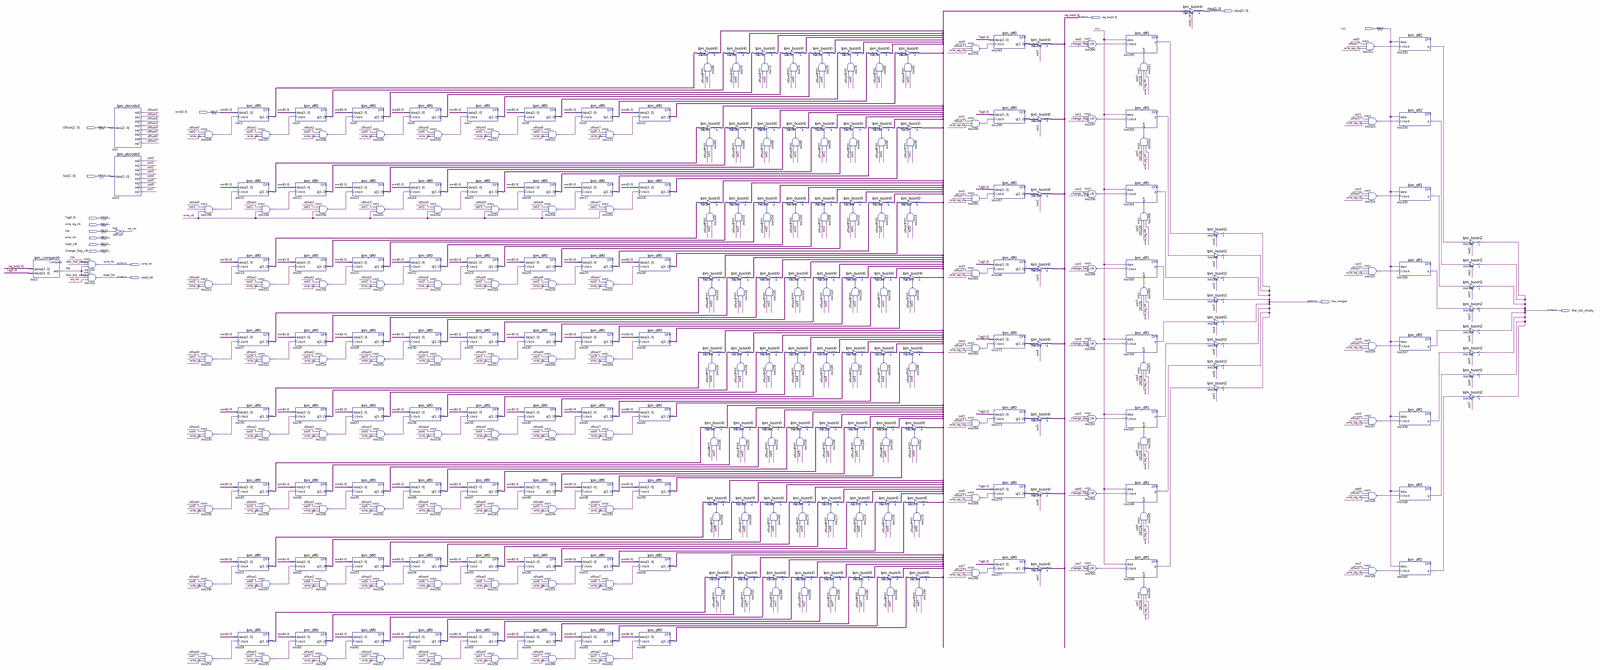
[diagram p0: schematic sheet, whole]
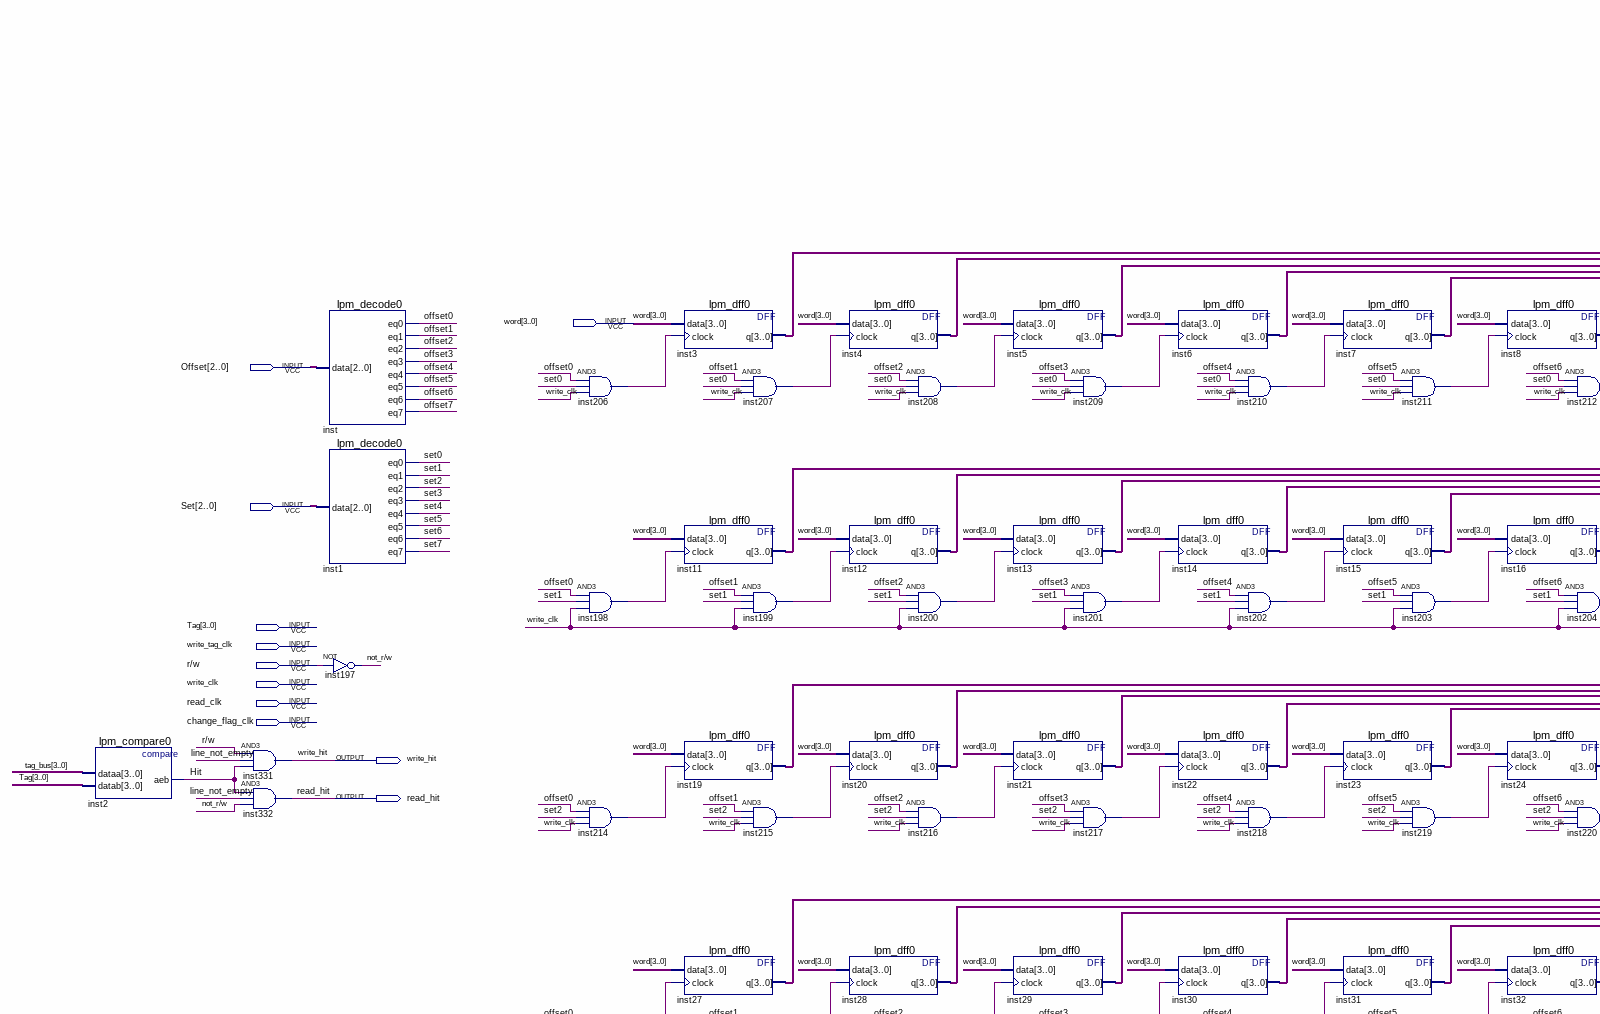
[diagram p1: schematic sheet, upper left part]
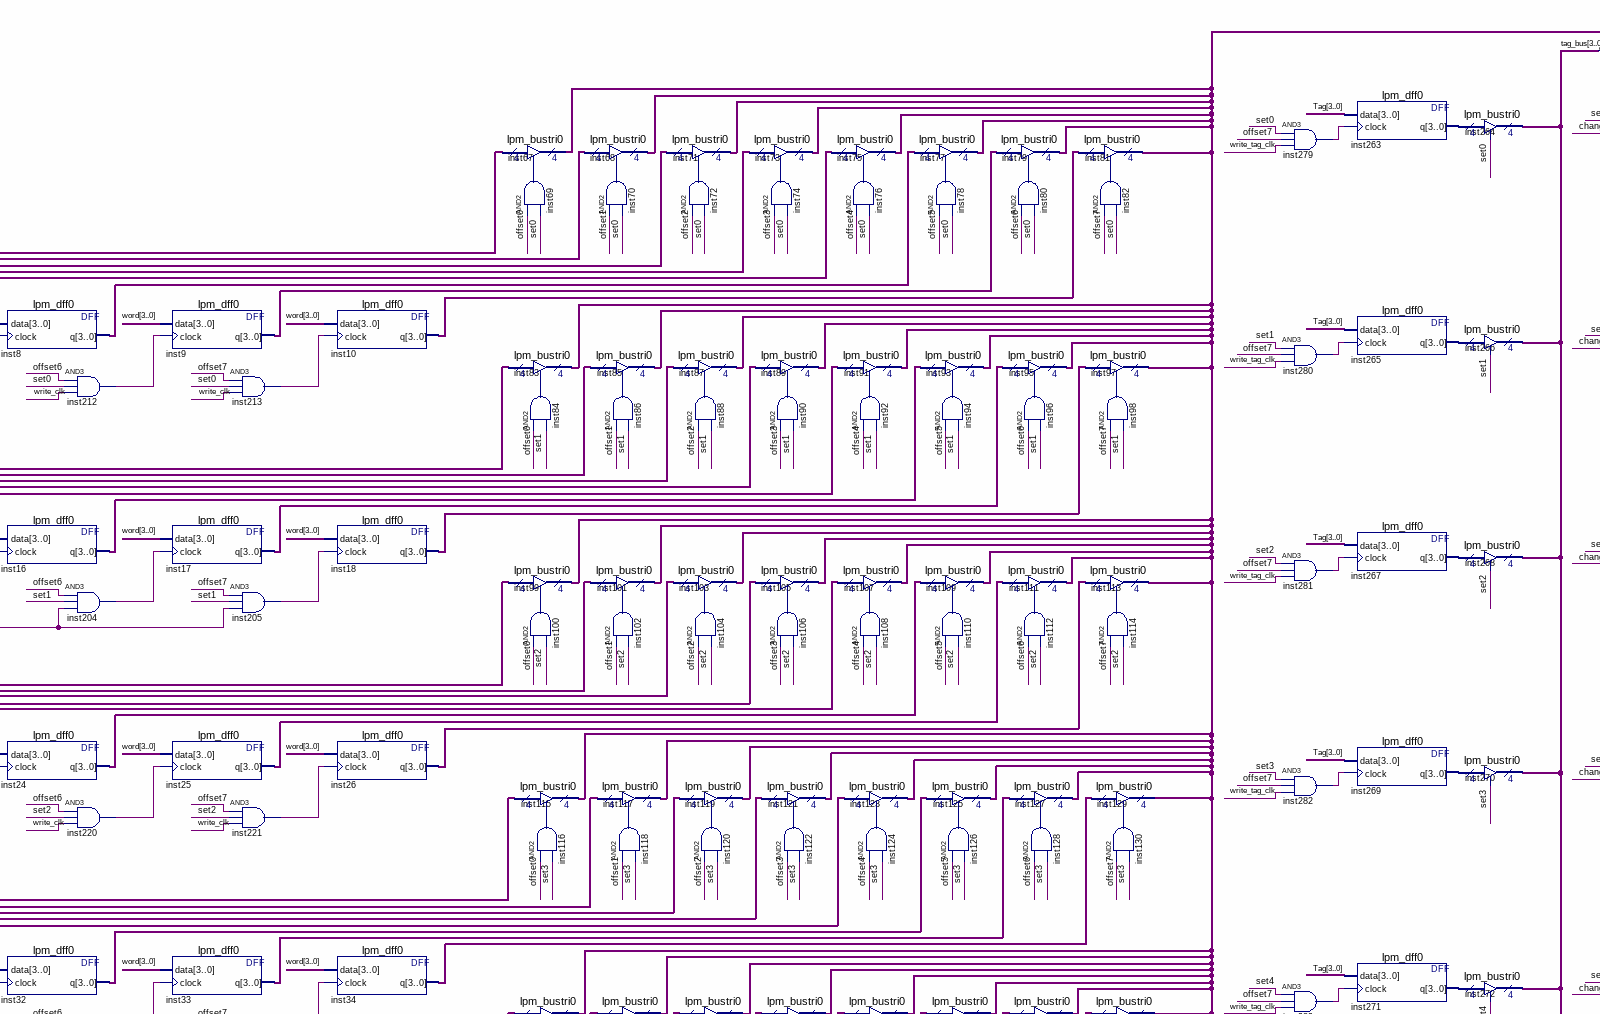
[diagram p2: schematic sheet, upper centre part]
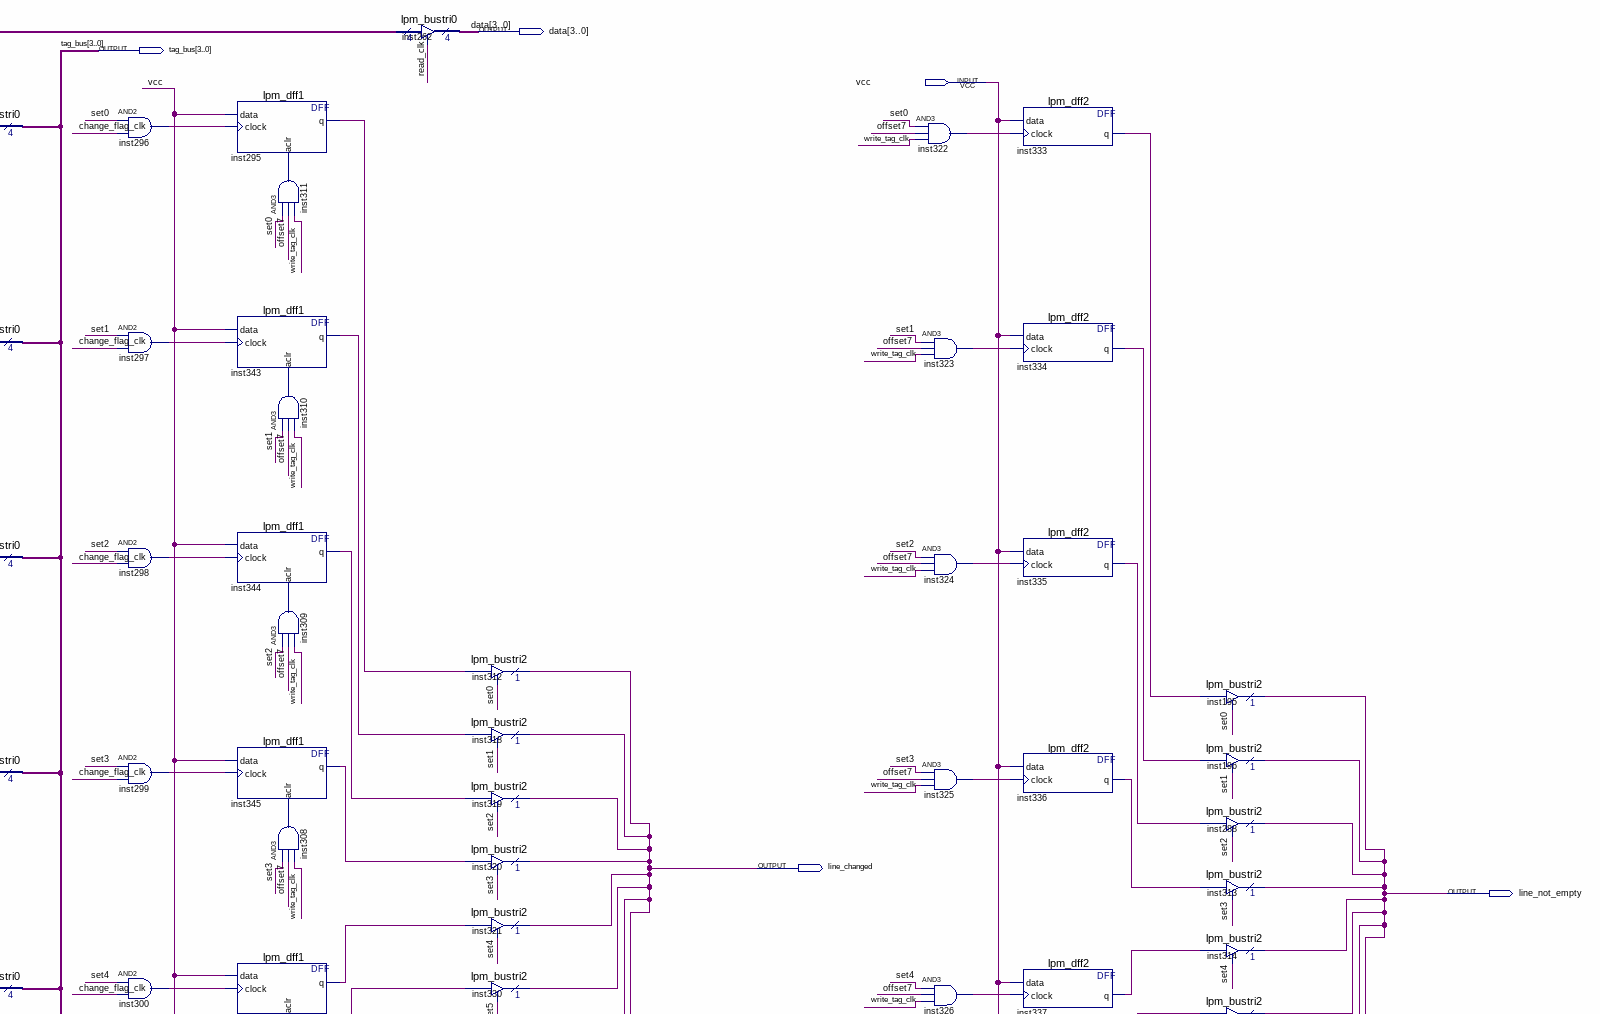
[diagram p3: schematic sheet, upper right part]
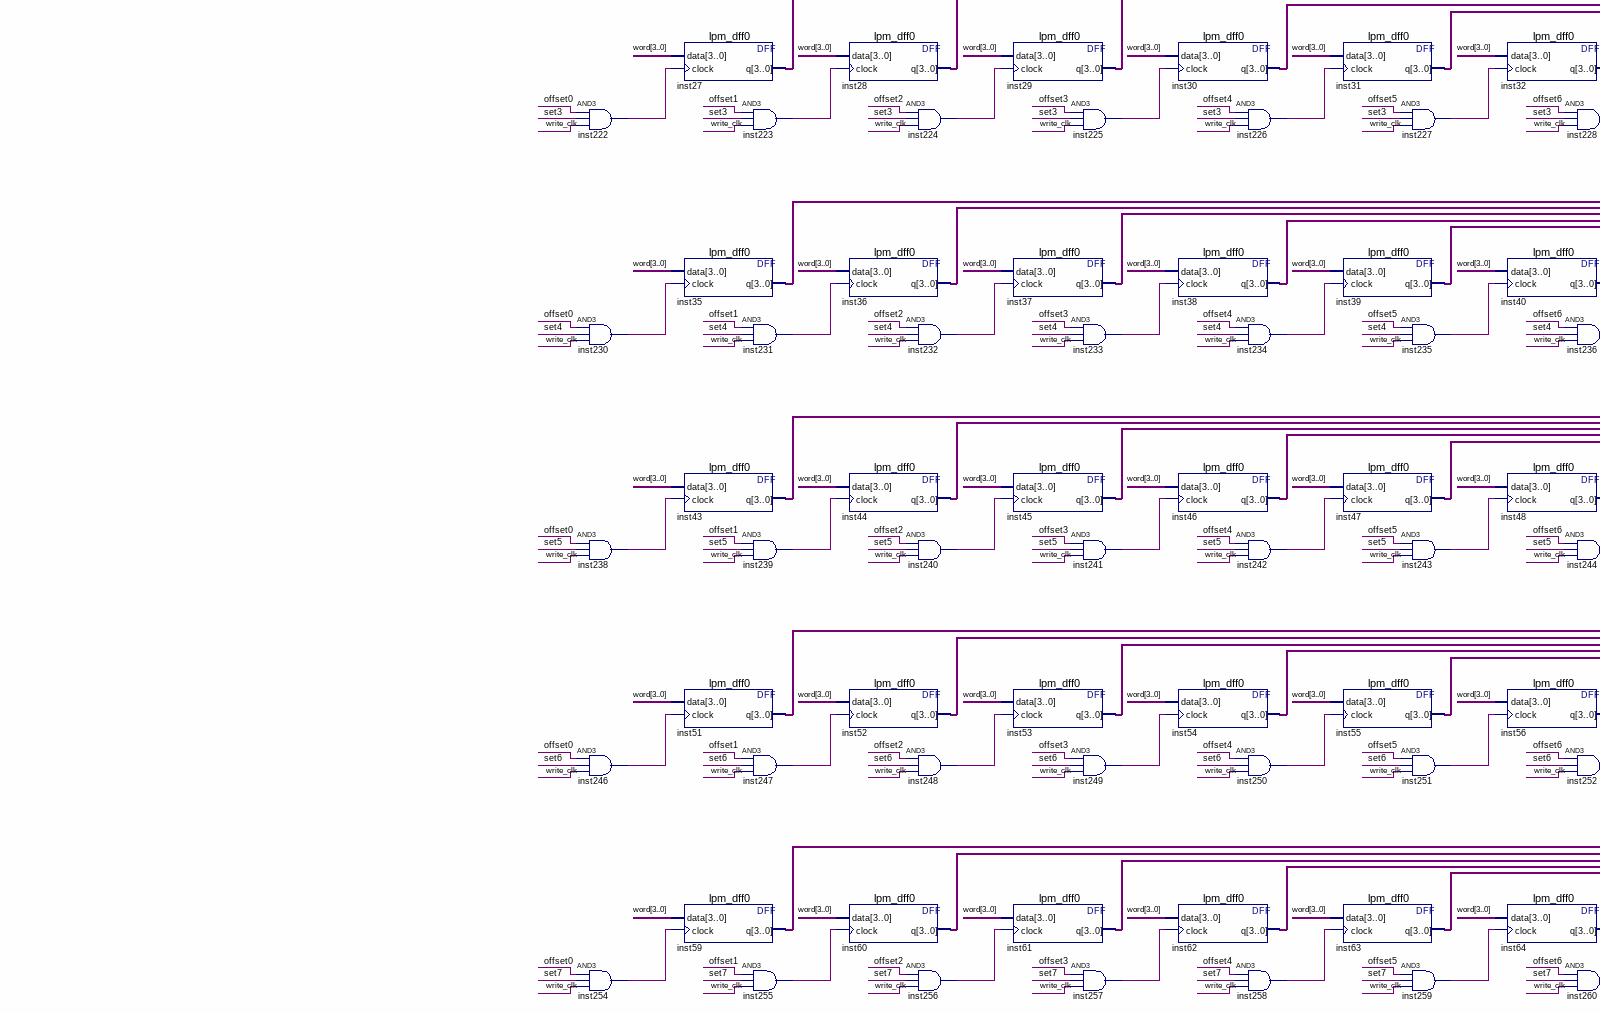
[diagram p4: schematic sheet, lower left part]
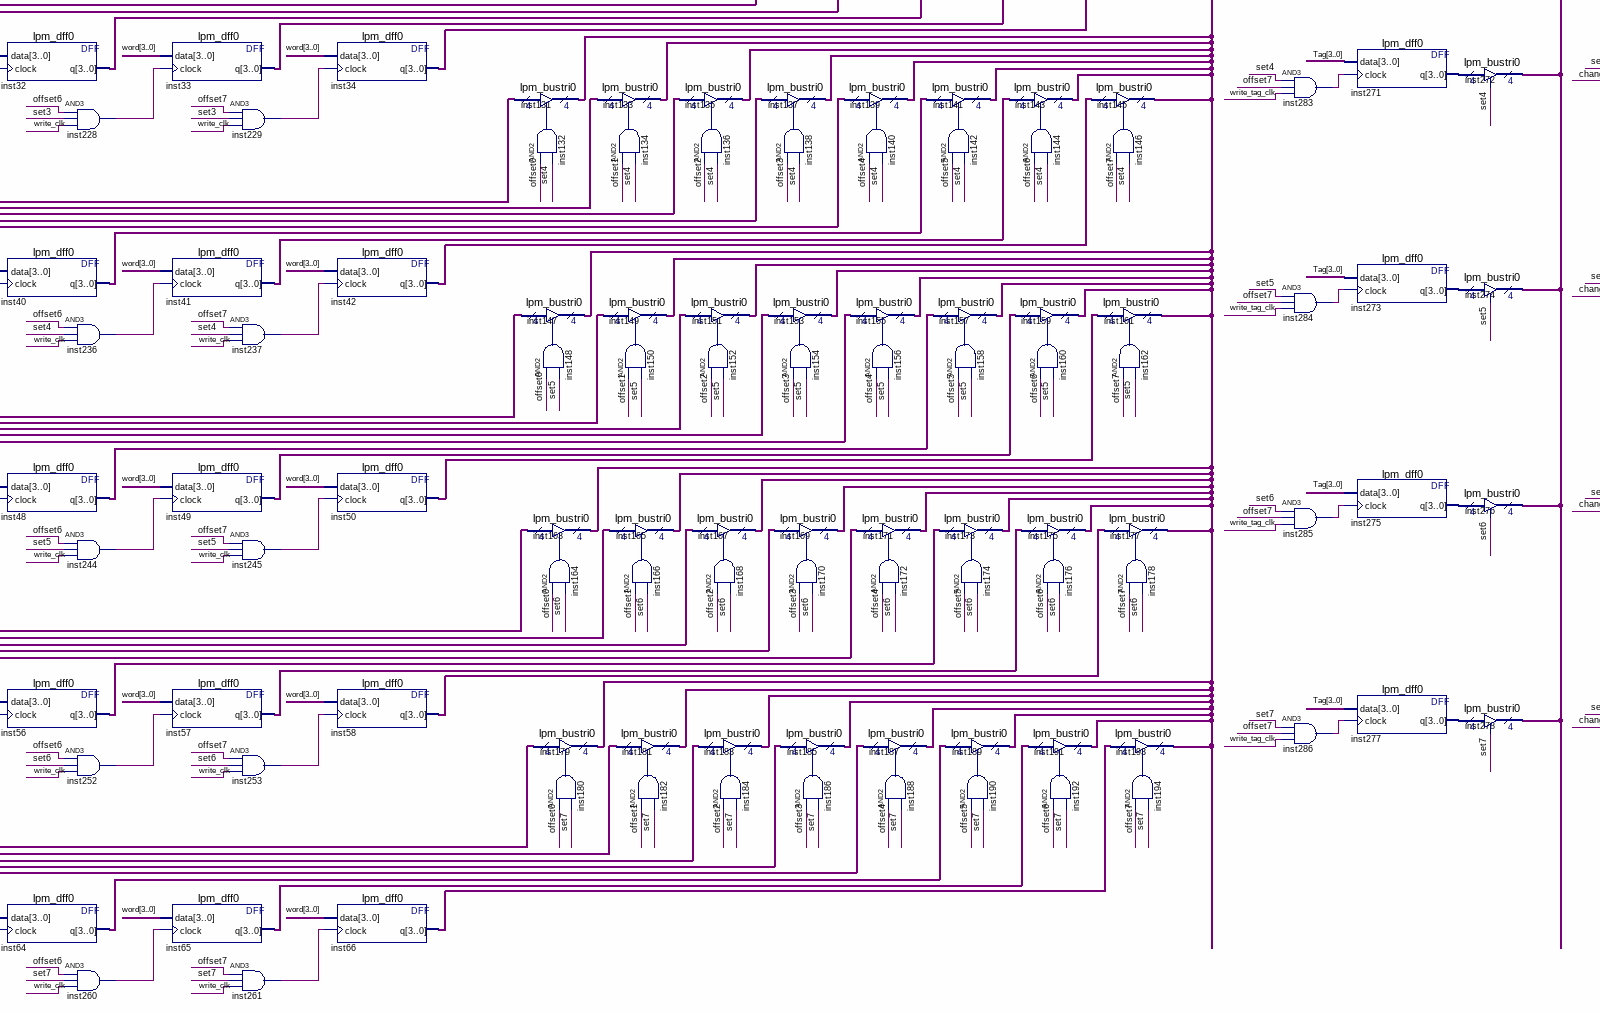
[diagram p5: schematic sheet, lower centre part]
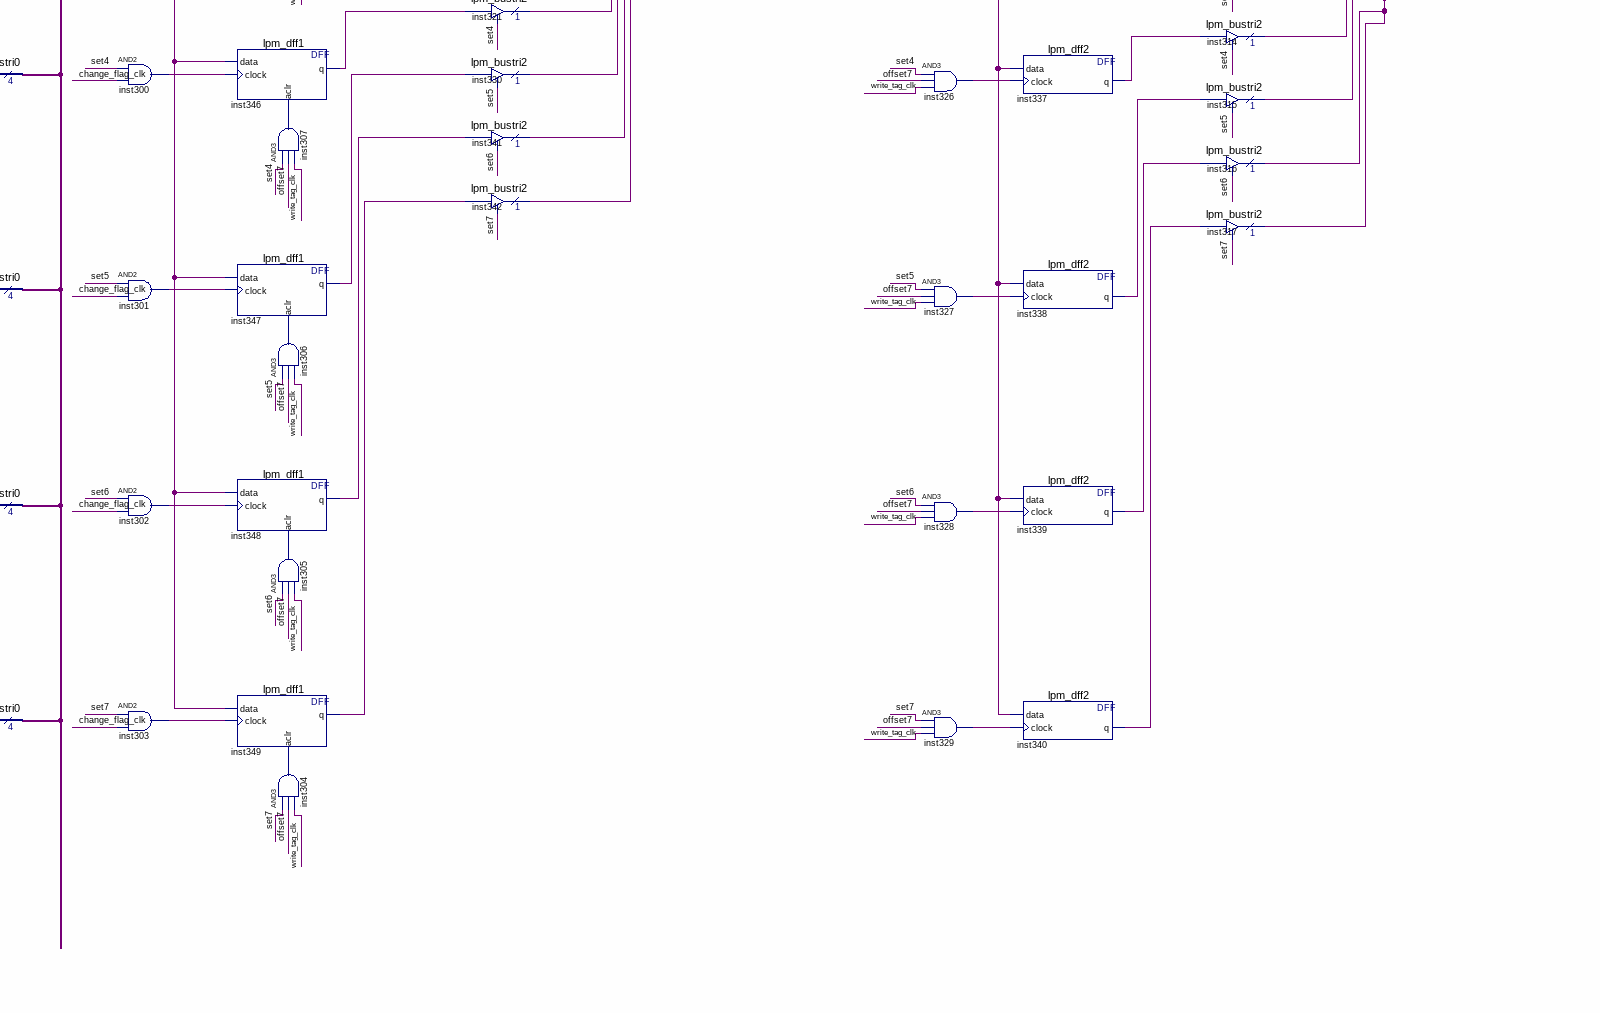
[diagram p6: schematic sheet, lower right part]
// Quartus schematic Cache.bdf as structural Verilog: 343 symbols, 16 pins
module Cache (
  input  vcc,
  input  [3:0] word,
  input  [2:0] Offset,
  input  [2:0] Set,
  input  [3:0] Tag,
  input  write_tag_clk,
  input  \r/w ,
  input  write_clk,
  input  read_clk,
  input  change_flag_clk,
  output [3:0] data,
  output [3:0] tag_bus,
  output write_hit,
  output read_hit,
  output line_changed,
  output line_not_empty
);

  wire Hit, inst69_out, inst70_out, inst72_out, inst74_out, inst76_out, inst78_out, inst80_out, inst82_out,
       inst84_out, inst86_out, inst88_out, inst90_out, inst92_out, inst94_out, inst96_out, inst98_out,
       inst100_out, inst102_out, inst104_out, inst106_out, inst108_out, inst110_out, inst112_out,
       inst114_out, inst116_out, inst118_out, inst120_out, inst122_out, inst124_out, inst126_out,
       inst128_out, inst130_out, inst132_out, inst134_out, inst136_out, inst138_out, inst140_out,
       inst142_out, inst144_out, inst146_out, inst148_out, inst150_out, inst152_out, inst154_out,
       inst156_out, inst158_out, inst160_out, inst162_out, inst164_out, inst166_out, inst168_out,
       inst170_out, inst172_out, inst174_out, inst176_out, inst178_out, inst180_out, inst182_out,
       inst184_out, inst186_out, inst188_out, inst190_out, inst192_out, inst194_out, inst198_out,
       inst199_out, inst200_out, inst201_out, inst202_out, inst203_out, inst204_out, inst205_out,
       inst206_out, inst207_out, inst208_out, inst209_out, inst210_out, inst211_out, inst212_out,
       inst213_out, inst214_out, inst215_out, inst216_out, inst217_out, inst218_out, inst219_out,
       inst220_out, inst221_out, inst222_out, inst223_out, inst224_out, inst225_out, inst226_out,
       inst227_out, inst228_out, inst229_out, inst230_out, inst231_out, inst232_out, inst233_out,
       inst234_out, inst235_out, inst236_out, inst237_out, inst238_out, inst239_out, inst240_out,
       inst241_out, inst242_out, inst243_out, inst244_out, inst245_out, inst246_out, inst247_out,
       inst248_out, inst249_out, inst250_out, inst251_out, inst252_out, inst253_out, inst254_out,
       inst255_out, inst256_out, inst257_out, inst258_out, inst259_out, inst260_out, inst261_out,
       inst279_out, inst280_out, inst281_out, inst282_out, inst283_out, inst284_out, inst285_out,
       inst286_out, inst295_q, inst296_out, inst297_out, inst298_out, inst299_out, inst300_out, inst301_out,
       inst302_out, inst303_out, inst304_out, inst305_out, inst306_out, inst307_out, inst308_out,
       inst309_out, inst310_out, inst311_out, inst322_out, inst323_out, inst324_out, inst325_out,
       inst326_out, inst327_out, inst328_out, inst329_out, inst333_q, inst334_q, inst335_q, inst336_q,
       inst337_q, inst338_q, inst339_q, inst340_q, inst343_q, inst344_q, inst345_q, inst346_q, inst347_q,
       inst348_q, inst349_q, \not_r/w , offset3, offset4, offset5, offset6, offset7, set3, set4, set5, set6,
       set7;
  wire [3:0] inst3_q, inst4_q, inst5_q, inst6_q, inst7_q, inst8_q, inst9_q, inst10_q, inst11_q, inst12_q,
       inst13_q, inst14_q, inst15_q, inst16_q, inst17_q, inst18_q, inst19_q, inst20_q, inst21_q, inst22_q,
       inst23_q, inst24_q, inst25_q, inst26_q, inst27_q, inst28_q, inst29_q, inst30_q, inst31_q, inst32_q,
       inst33_q, inst34_q, inst35_q, inst36_q, inst37_q, inst38_q, inst39_q, inst40_q, inst41_q, inst42_q,
       inst43_q, inst44_q, inst45_q, inst46_q, inst47_q, inst48_q, inst49_q, inst50_q, inst51_q, inst52_q,
       inst53_q, inst54_q, inst55_q, inst56_q, inst57_q, inst58_q, inst59_q, inst60_q, inst61_q, inst62_q,
       inst63_q, inst64_q, inst65_q, inst66_q, inst67_tridata, inst263_q, inst265_q, inst267_q, inst269_q,
       inst271_q, inst273_q, inst275_q, inst277_q;

  lpm_compare0 inst2 (.dataa(tag_bus), .datab(Tag), .aeb(Hit));
  and inst331 (write_hit, \r/w , line_not_empty, Hit);
  and inst332 (read_hit, Hit, line_not_empty, \not_r/w );
  lpm_decode0 inst (
    .data(Offset), .eq0(Offset[0]), .eq1(Offset[1]), .eq2(Offset[2]), .eq3(offset3), .eq4(offset4),
    .eq5(offset5), .eq6(offset6), .eq7(offset7));
  lpm_decode0 inst1 (
    .data(Set), .eq0(Set[0]), .eq1(Set[1]), .eq2(Set[2]), .eq3(set3), .eq4(set4), .eq5(set5), .eq6(set6),
    .eq7(set7));
  not inst197 (\not_r/w , \r/w );
  and inst206 (inst206_out, Offset[0], Set[0], write_clk);
  and inst198 (inst198_out, Offset[0], Set[1], write_clk);
  and inst214 (inst214_out, Offset[0], Set[2], write_clk);
  and inst222 (inst222_out, Offset[0], set3, write_clk);
  and inst230 (inst230_out, Offset[0], set4, write_clk);
  and inst238 (inst238_out, Offset[0], set5, write_clk);
  and inst246 (inst246_out, Offset[0], set6, write_clk);
  and inst254 (inst254_out, Offset[0], set7, write_clk);
  lpm_dff0 inst3 (.data(word), .clock(inst206_out), .q(inst3_q));
  lpm_dff0 inst11 (.data(word), .clock(inst198_out), .q(inst11_q));
  lpm_dff0 inst19 (.data(word), .clock(inst214_out), .q(inst19_q));
  lpm_dff0 inst27 (.data(word), .clock(inst222_out), .q(inst27_q));
  lpm_dff0 inst35 (.data(word), .clock(inst230_out), .q(inst35_q));
  lpm_dff0 inst43 (.data(word), .clock(inst238_out), .q(inst43_q));
  lpm_dff0 inst51 (.data(word), .clock(inst246_out), .q(inst51_q));
  lpm_dff0 inst59 (.data(word), .clock(inst254_out), .q(inst59_q));
  and inst207 (inst207_out, Offset[1], Set[0], write_clk);
  and inst199 (inst199_out, Offset[1], Set[1], write_clk);
  and inst215 (inst215_out, Offset[1], Set[2], write_clk);
  and inst223 (inst223_out, Offset[1], set3, write_clk);
  and inst231 (inst231_out, Offset[1], set4, write_clk);
  and inst239 (inst239_out, Offset[1], set5, write_clk);
  and inst247 (inst247_out, Offset[1], set6, write_clk);
  and inst255 (inst255_out, Offset[1], set7, write_clk);
  lpm_dff0 inst4 (.data(word), .clock(inst207_out), .q(inst4_q));
  lpm_dff0 inst12 (.data(word), .clock(inst199_out), .q(inst12_q));
  lpm_dff0 inst20 (.data(word), .clock(inst215_out), .q(inst20_q));
  lpm_dff0 inst28 (.data(word), .clock(inst223_out), .q(inst28_q));
  lpm_dff0 inst36 (.data(word), .clock(inst231_out), .q(inst36_q));
  lpm_dff0 inst44 (.data(word), .clock(inst239_out), .q(inst44_q));
  lpm_dff0 inst52 (.data(word), .clock(inst247_out), .q(inst52_q));
  lpm_dff0 inst60 (.data(word), .clock(inst255_out), .q(inst60_q));
  and inst208 (inst208_out, Offset[2], Set[0], write_clk);
  and inst200 (inst200_out, Offset[2], Set[1], write_clk);
  and inst216 (inst216_out, Offset[2], Set[2], write_clk);
  and inst224 (inst224_out, Offset[2], set3, write_clk);
  and inst232 (inst232_out, Offset[2], set4, write_clk);
  and inst240 (inst240_out, Offset[2], set5, write_clk);
  and inst248 (inst248_out, Offset[2], set6, write_clk);
  and inst256 (inst256_out, Offset[2], set7, write_clk);
  lpm_dff0 inst5 (.data(word), .clock(inst208_out), .q(inst5_q));
  lpm_dff0 inst13 (.data(word), .clock(inst200_out), .q(inst13_q));
  lpm_dff0 inst21 (.data(word), .clock(inst216_out), .q(inst21_q));
  lpm_dff0 inst29 (.data(word), .clock(inst224_out), .q(inst29_q));
  lpm_dff0 inst37 (.data(word), .clock(inst232_out), .q(inst37_q));
  lpm_dff0 inst45 (.data(word), .clock(inst240_out), .q(inst45_q));
  lpm_dff0 inst53 (.data(word), .clock(inst248_out), .q(inst53_q));
  lpm_dff0 inst61 (.data(word), .clock(inst256_out), .q(inst61_q));
  and inst209 (inst209_out, offset3, Set[0], write_clk);
  and inst201 (inst201_out, offset3, Set[1], write_clk);
  and inst217 (inst217_out, offset3, Set[2], write_clk);
  and inst225 (inst225_out, offset3, set3, write_clk);
  and inst233 (inst233_out, offset3, set4, write_clk);
  and inst241 (inst241_out, offset3, set5, write_clk);
  and inst249 (inst249_out, offset3, set6, write_clk);
  and inst257 (inst257_out, offset3, set7, write_clk);
  lpm_dff0 inst6 (.data(word), .clock(inst209_out), .q(inst6_q));
  lpm_dff0 inst14 (.data(word), .clock(inst201_out), .q(inst14_q));
  lpm_dff0 inst22 (.data(word), .clock(inst217_out), .q(inst22_q));
  lpm_dff0 inst30 (.data(word), .clock(inst225_out), .q(inst30_q));
  lpm_dff0 inst38 (.data(word), .clock(inst233_out), .q(inst38_q));
  lpm_dff0 inst46 (.data(word), .clock(inst241_out), .q(inst46_q));
  lpm_dff0 inst54 (.data(word), .clock(inst249_out), .q(inst54_q));
  lpm_dff0 inst62 (.data(word), .clock(inst257_out), .q(inst62_q));
  and inst210 (inst210_out, offset4, Set[0], write_clk);
  and inst202 (inst202_out, offset4, Set[1], write_clk);
  and inst218 (inst218_out, offset4, Set[2], write_clk);
  and inst226 (inst226_out, offset4, set3, write_clk);
  and inst234 (inst234_out, offset4, set4, write_clk);
  and inst242 (inst242_out, offset4, set5, write_clk);
  and inst250 (inst250_out, offset4, set6, write_clk);
  and inst258 (inst258_out, offset4, set7, write_clk);
  lpm_dff0 inst7 (.data(word), .clock(inst210_out), .q(inst7_q));
  lpm_dff0 inst15 (.data(word), .clock(inst202_out), .q(inst15_q));
  lpm_dff0 inst23 (.data(word), .clock(inst218_out), .q(inst23_q));
  lpm_dff0 inst31 (.data(word), .clock(inst226_out), .q(inst31_q));
  lpm_dff0 inst39 (.data(word), .clock(inst234_out), .q(inst39_q));
  lpm_dff0 inst47 (.data(word), .clock(inst242_out), .q(inst47_q));
  lpm_dff0 inst55 (.data(word), .clock(inst250_out), .q(inst55_q));
  lpm_dff0 inst63 (.data(word), .clock(inst258_out), .q(inst63_q));
  and inst211 (inst211_out, offset5, Set[0], write_clk);
  and inst203 (inst203_out, offset5, Set[1], write_clk);
  and inst219 (inst219_out, offset5, Set[2], write_clk);
  and inst227 (inst227_out, offset5, set3, write_clk);
  and inst235 (inst235_out, offset5, set4, write_clk);
  and inst243 (inst243_out, offset5, set5, write_clk);
  and inst251 (inst251_out, offset5, set6, write_clk);
  and inst259 (inst259_out, offset5, set7, write_clk);
  lpm_dff0 inst8 (.data(word), .clock(inst211_out), .q(inst8_q));
  lpm_dff0 inst16 (.data(word), .clock(inst203_out), .q(inst16_q));
  lpm_dff0 inst24 (.data(word), .clock(inst219_out), .q(inst24_q));
  lpm_dff0 inst32 (.data(word), .clock(inst227_out), .q(inst32_q));
  lpm_dff0 inst40 (.data(word), .clock(inst235_out), .q(inst40_q));
  lpm_dff0 inst48 (.data(word), .clock(inst243_out), .q(inst48_q));
  lpm_dff0 inst56 (.data(word), .clock(inst251_out), .q(inst56_q));
  lpm_dff0 inst64 (.data(word), .clock(inst259_out), .q(inst64_q));
  and inst212 (inst212_out, offset6, Set[0], write_clk);
  and inst204 (inst204_out, offset6, Set[1], write_clk);
  and inst220 (inst220_out, offset6, Set[2], write_clk);
  and inst228 (inst228_out, offset6, set3, write_clk);
  and inst236 (inst236_out, offset6, set4, write_clk);
  and inst244 (inst244_out, offset6, set5, write_clk);
  and inst252 (inst252_out, offset6, set6, write_clk);
  and inst260 (inst260_out, offset6, set7, write_clk);
  lpm_dff0 inst9 (.data(word), .clock(inst212_out), .q(inst9_q));
  lpm_dff0 inst17 (.data(word), .clock(inst204_out), .q(inst17_q));
  lpm_dff0 inst25 (.data(word), .clock(inst220_out), .q(inst25_q));
  lpm_dff0 inst33 (.data(word), .clock(inst228_out), .q(inst33_q));
  lpm_dff0 inst41 (.data(word), .clock(inst236_out), .q(inst41_q));
  lpm_dff0 inst49 (.data(word), .clock(inst244_out), .q(inst49_q));
  lpm_dff0 inst57 (.data(word), .clock(inst252_out), .q(inst57_q));
  lpm_dff0 inst65 (.data(word), .clock(inst260_out), .q(inst65_q));
  and inst213 (inst213_out, offset7, Set[0], write_clk);
  and inst205 (inst205_out, offset7, Set[1], write_clk);
  and inst221 (inst221_out, offset7, Set[2], write_clk);
  and inst229 (inst229_out, offset7, set3, write_clk);
  and inst237 (inst237_out, offset7, set4, write_clk);
  and inst245 (inst245_out, offset7, set5, write_clk);
  and inst253 (inst253_out, offset7, set6, write_clk);
  and inst261 (inst261_out, offset7, set7, write_clk);
  lpm_dff0 inst10 (.data(word), .clock(inst213_out), .q(inst10_q));
  lpm_dff0 inst18 (.data(word), .clock(inst205_out), .q(inst18_q));
  lpm_dff0 inst26 (.data(word), .clock(inst221_out), .q(inst26_q));
  lpm_dff0 inst34 (.data(word), .clock(inst229_out), .q(inst34_q));
  lpm_dff0 inst42 (.data(word), .clock(inst237_out), .q(inst42_q));
  lpm_dff0 inst50 (.data(word), .clock(inst245_out), .q(inst50_q));
  lpm_dff0 inst58 (.data(word), .clock(inst253_out), .q(inst58_q));
  lpm_dff0 inst66 (.data(word), .clock(inst261_out), .q(inst66_q));
  lpm_bustri0 inst67 (.enabledt(inst69_out), .data(inst3_q), .tridata(inst67_tridata));
  and inst69 (inst69_out, Offset[0], Set[0]);
  lpm_bustri0 inst83 (.enabledt(inst84_out), .data(inst11_q), .tridata(inst67_tridata));
  lpm_bustri0 inst99 (.enabledt(inst100_out), .data(inst19_q), .tridata(inst67_tridata));
  lpm_bustri0 inst115 (.enabledt(inst116_out), .data(inst27_q), .tridata(inst67_tridata));
  lpm_bustri0 inst131 (.enabledt(inst132_out), .data(inst35_q), .tridata(inst67_tridata));
  and inst84 (inst84_out, Offset[0], Set[1]);
  and inst100 (inst100_out, Offset[0], Set[2]);
  and inst116 (inst116_out, Offset[0], set3);
  and inst132 (inst132_out, Offset[0], set4);
  lpm_bustri0 inst147 (.enabledt(inst148_out), .data(inst43_q), .tridata(inst67_tridata));
  and inst148 (inst148_out, Offset[0], set5);
  lpm_bustri0 inst163 (.enabledt(inst164_out), .data(inst51_q), .tridata(inst67_tridata));
  and inst164 (inst164_out, Offset[0], set6);
  lpm_bustri0 inst179 (.enabledt(inst180_out), .data(inst59_q), .tridata(inst67_tridata));
  and inst180 (inst180_out, Offset[0], set7);
  lpm_bustri0 inst68 (.enabledt(inst70_out), .data(inst4_q), .tridata(inst67_tridata));
  and inst70 (inst70_out, Offset[1], Set[0]);
  lpm_bustri0 inst85 (.enabledt(inst86_out), .data(inst12_q), .tridata(inst67_tridata));
  and inst86 (inst86_out, Offset[1], Set[1]);
  lpm_bustri0 inst101 (.enabledt(inst102_out), .data(inst20_q), .tridata(inst67_tridata));
  and inst102 (inst102_out, Offset[1], Set[2]);
  lpm_bustri0 inst117 (.enabledt(inst118_out), .data(inst28_q), .tridata(inst67_tridata));
  and inst118 (inst118_out, Offset[1], set3);
  lpm_bustri0 inst133 (.enabledt(inst134_out), .data(inst36_q), .tridata(inst67_tridata));
  and inst134 (inst134_out, Offset[1], set4);
  lpm_bustri0 inst149 (.enabledt(inst150_out), .data(inst44_q), .tridata(inst67_tridata));
  and inst150 (inst150_out, Offset[1], set5);
  lpm_bustri0 inst165 (.enabledt(inst166_out), .data(inst52_q), .tridata(inst67_tridata));
  lpm_bustri0 inst181 (.enabledt(inst182_out), .data(inst60_q), .tridata(inst67_tridata));
  lpm_bustri0 inst71 (.enabledt(inst72_out), .data(inst5_q), .tridata(inst67_tridata));
  and inst166 (inst166_out, Offset[1], set6);
  and inst182 (inst182_out, Offset[1], set7);
  and inst72 (inst72_out, Offset[2], Set[0]);
  lpm_bustri0 inst87 (.enabledt(inst88_out), .data(inst13_q), .tridata(inst67_tridata));
  and inst88 (inst88_out, Offset[2], Set[1]);
  lpm_bustri0 inst103 (.enabledt(inst104_out), .data(inst21_q), .tridata(inst67_tridata));
  and inst104 (inst104_out, Offset[2], Set[2]);
  lpm_bustri0 inst119 (.enabledt(inst120_out), .data(inst29_q), .tridata(inst67_tridata));
  and inst120 (inst120_out, Offset[2], set3);
  lpm_bustri0 inst135 (.enabledt(inst136_out), .data(inst37_q), .tridata(inst67_tridata));
  and inst136 (inst136_out, Offset[2], set4);
  lpm_bustri0 inst151 (.enabledt(inst152_out), .data(inst45_q), .tridata(inst67_tridata));
  and inst152 (inst152_out, Offset[2], set5);
  lpm_bustri0 inst167 (.enabledt(inst168_out), .data(inst53_q), .tridata(inst67_tridata));
  and inst168 (inst168_out, Offset[2], set6);
  lpm_bustri0 inst183 (.enabledt(inst184_out), .data(inst61_q), .tridata(inst67_tridata));
  and inst184 (inst184_out, Offset[2], set7);
  lpm_bustri0 inst73 (.enabledt(inst74_out), .data(inst6_q), .tridata(inst67_tridata));
  and inst74 (inst74_out, offset3, Set[0]);
  lpm_bustri0 inst89 (.enabledt(inst90_out), .data(inst14_q), .tridata(inst67_tridata));
  and inst90 (inst90_out, offset3, Set[1]);
  lpm_bustri0 inst105 (.enabledt(inst106_out), .data(inst22_q), .tridata(inst67_tridata));
  and inst106 (inst106_out, offset3, Set[2]);
  lpm_bustri0 inst121 (.enabledt(inst122_out), .data(inst30_q), .tridata(inst67_tridata));
  lpm_bustri0 inst137 (.enabledt(inst138_out), .data(inst38_q), .tridata(inst67_tridata));
  lpm_bustri0 inst153 (.enabledt(inst154_out), .data(inst46_q), .tridata(inst67_tridata));
  and inst122 (inst122_out, offset3, set3);
  and inst138 (inst138_out, offset3, set4);
  and inst154 (inst154_out, offset3, set5);
  lpm_bustri0 inst169 (.enabledt(inst170_out), .data(inst54_q), .tridata(inst67_tridata));
  and inst170 (inst170_out, offset3, set6);
  lpm_bustri0 inst185 (.enabledt(inst186_out), .data(inst62_q), .tridata(inst67_tridata));
  and inst186 (inst186_out, offset3, set7);
  lpm_bustri0 inst75 (.enabledt(inst76_out), .data(inst7_q), .tridata(inst67_tridata));
  and inst76 (inst76_out, offset4, Set[0]);
  lpm_bustri0 inst91 (.enabledt(inst92_out), .data(inst15_q), .tridata(inst67_tridata));
  and inst92 (inst92_out, offset4, Set[1]);
  lpm_bustri0 inst107 (.enabledt(inst108_out), .data(inst23_q), .tridata(inst67_tridata));
  and inst108 (inst108_out, offset4, Set[2]);
  lpm_bustri0 inst123 (.enabledt(inst124_out), .data(inst31_q), .tridata(inst67_tridata));
  and inst124 (inst124_out, offset4, set3);
  lpm_bustri0 inst139 (.enabledt(inst140_out), .data(inst39_q), .tridata(inst67_tridata));
  and inst140 (inst140_out, offset4, set4);
  lpm_bustri0 inst155 (.enabledt(inst156_out), .data(inst47_q), .tridata(inst67_tridata));
  and inst156 (inst156_out, offset4, set5);
  lpm_bustri0 inst171 (.enabledt(inst172_out), .data(inst55_q), .tridata(inst67_tridata));
  and inst172 (inst172_out, offset4, set6);
  lpm_bustri0 inst187 (.enabledt(inst188_out), .data(inst63_q), .tridata(inst67_tridata));
  lpm_bustri0 inst77 (.enabledt(inst78_out), .data(inst8_q), .tridata(inst67_tridata));
  lpm_bustri0 inst93 (.enabledt(inst94_out), .data(inst16_q), .tridata(inst67_tridata));
  lpm_bustri0 inst109 (.enabledt(inst110_out), .data(inst24_q), .tridata(inst67_tridata));
  and inst188 (inst188_out, offset4, set7);
  and inst78 (inst78_out, offset5, Set[0]);
  and inst94 (inst94_out, offset5, Set[1]);
  and inst110 (inst110_out, offset5, Set[2]);
  lpm_bustri0 inst125 (.enabledt(inst126_out), .data(inst32_q), .tridata(inst67_tridata));
  and inst126 (inst126_out, offset5, set3);
  lpm_bustri0 inst141 (.enabledt(inst142_out), .data(inst40_q), .tridata(inst67_tridata));
  and inst142 (inst142_out, offset5, set4);
  lpm_bustri0 inst157 (.enabledt(inst158_out), .data(inst48_q), .tridata(inst67_tridata));
  and inst158 (inst158_out, offset5, set5);
  lpm_bustri0 inst173 (.enabledt(inst174_out), .data(inst56_q), .tridata(inst67_tridata));
  and inst174 (inst174_out, offset5, set6);
  lpm_bustri0 inst189 (.enabledt(inst190_out), .data(inst64_q), .tridata(inst67_tridata));
  and inst190 (inst190_out, offset5, set7);
  lpm_bustri0 inst79 (.enabledt(inst80_out), .data(inst9_q), .tridata(inst67_tridata));
  and inst80 (inst80_out, offset6, Set[0]);
  lpm_bustri0 inst95 (.enabledt(inst96_out), .data(inst17_q), .tridata(inst67_tridata));
  and inst96 (inst96_out, offset6, Set[1]);
  lpm_bustri0 inst111 (.enabledt(inst112_out), .data(inst25_q), .tridata(inst67_tridata));
  and inst112 (inst112_out, offset6, Set[2]);
  lpm_bustri0 inst127 (.enabledt(inst128_out), .data(inst33_q), .tridata(inst67_tridata));
  and inst128 (inst128_out, offset6, set3);
  lpm_bustri0 inst143 (.enabledt(inst144_out), .data(inst41_q), .tridata(inst67_tridata));
  and inst144 (inst144_out, offset6, set4);
  lpm_bustri0 inst159 (.enabledt(inst160_out), .data(inst49_q), .tridata(inst67_tridata));
  lpm_bustri0 inst175 (.enabledt(inst176_out), .data(inst57_q), .tridata(inst67_tridata));
  and inst160 (inst160_out, offset6, set5);
  and inst176 (inst176_out, offset6, set6);
  lpm_bustri0 inst191 (.enabledt(inst192_out), .data(inst65_q), .tridata(inst67_tridata));
  and inst192 (inst192_out, offset6, set7);
  lpm_bustri0 inst81 (.enabledt(inst82_out), .data(inst10_q), .tridata(inst67_tridata));
  and inst82 (inst82_out, offset7, Set[0]);
  lpm_bustri0 inst97 (.enabledt(inst98_out), .data(inst18_q), .tridata(inst67_tridata));
  and inst98 (inst98_out, offset7, Set[1]);
  lpm_bustri0 inst113 (.enabledt(inst114_out), .data(inst26_q), .tridata(inst67_tridata));
  and inst114 (inst114_out, offset7, Set[2]);
  lpm_bustri0 inst129 (.enabledt(inst130_out), .data(inst34_q), .tridata(inst67_tridata));
  and inst130 (inst130_out, offset7, set3);
  lpm_bustri0 inst145 (.enabledt(inst146_out), .data(inst42_q), .tridata(inst67_tridata));
  and inst146 (inst146_out, offset7, set4);
  lpm_bustri0 inst161 (.enabledt(inst162_out), .data(inst50_q), .tridata(inst67_tridata));
  and inst162 (inst162_out, offset7, set5);
  lpm_bustri0 inst177 (.enabledt(inst178_out), .data(inst58_q), .tridata(inst67_tridata));
  and inst178 (inst178_out, offset7, set6);
  lpm_bustri0 inst193 (.enabledt(inst194_out), .data(inst66_q), .tridata(inst67_tridata));
  and inst194 (inst194_out, offset7, set7);
  and inst279 (inst279_out, Set[0], offset7, write_tag_clk);
  and inst280 (inst280_out, Set[1], offset7, write_tag_clk);
  and inst281 (inst281_out, Set[2], offset7, write_tag_clk);
  and inst282 (inst282_out, set3, offset7, write_tag_clk);
  and inst283 (inst283_out, set4, offset7, write_tag_clk);
  and inst284 (inst284_out, set5, offset7, write_tag_clk);
  and inst285 (inst285_out, set6, offset7, write_tag_clk);
  and inst286 (inst286_out, set7, offset7, write_tag_clk);
  lpm_dff0 inst263 (.data(Tag), .clock(inst279_out), .q(inst263_q));
  lpm_dff0 inst265 (.data(Tag), .clock(inst280_out), .q(inst265_q));
  lpm_dff0 inst267 (.data(Tag), .clock(inst281_out), .q(inst267_q));
  lpm_dff0 inst269 (.data(Tag), .clock(inst282_out), .q(inst269_q));
  lpm_dff0 inst271 (.data(Tag), .clock(inst283_out), .q(inst271_q));
  lpm_dff0 inst273 (.data(Tag), .clock(inst284_out), .q(inst273_q));
  lpm_dff0 inst275 (.data(Tag), .clock(inst285_out), .q(inst275_q));
  lpm_dff0 inst277 (.data(Tag), .clock(inst286_out), .q(inst277_q));
  lpm_bustri0 inst264 (.enabledt(Set[0]), .data(inst263_q), .tridata(tag_bus));
  lpm_bustri0 inst266 (.enabledt(Set[1]), .data(inst265_q), .tridata(tag_bus));
  lpm_bustri0 inst268 (.enabledt(Set[2]), .data(inst267_q), .tridata(tag_bus));
  lpm_bustri0 inst270 (.enabledt(set3), .data(inst269_q), .tridata(tag_bus));
  lpm_bustri0 inst272 (.enabledt(set4), .data(inst271_q), .tridata(tag_bus));
  lpm_bustri0 inst274 (.enabledt(set5), .data(inst273_q), .tridata(tag_bus));
  lpm_bustri0 inst276 (.enabledt(set6), .data(inst275_q), .tridata(tag_bus));
  lpm_bustri0 inst278 (.enabledt(set7), .data(inst277_q), .tridata(tag_bus));
  and inst296 (inst296_out, Set[0], change_flag_clk);
  and inst297 (inst297_out, Set[1], change_flag_clk);
  and inst298 (inst298_out, Set[2], change_flag_clk);
  and inst299 (inst299_out, set3, change_flag_clk);
  and inst300 (inst300_out, set4, change_flag_clk);
  and inst301 (inst301_out, set5, change_flag_clk);
  and inst302 (inst302_out, set6, change_flag_clk);
  and inst303 (inst303_out, set7, change_flag_clk);
  lpm_dff1 inst295 (.data(vcc), .clock(inst296_out), .aclr(inst311_out), .q(inst295_q));
  lpm_dff1 inst343 (.data(vcc), .clock(inst297_out), .aclr(inst310_out), .q(inst343_q));
  lpm_dff1 inst344 (.data(vcc), .clock(inst298_out), .aclr(inst309_out), .q(inst344_q));
  lpm_dff1 inst345 (.data(vcc), .clock(inst299_out), .aclr(inst308_out), .q(inst345_q));
  lpm_dff1 inst346 (.data(vcc), .clock(inst300_out), .aclr(inst307_out), .q(inst346_q));
  lpm_dff1 inst347 (.data(vcc), .clock(inst301_out), .aclr(inst306_out), .q(inst347_q));
  lpm_dff1 inst348 (.data(vcc), .clock(inst302_out), .aclr(inst305_out), .q(inst348_q));
  lpm_dff1 inst349 (.data(vcc), .clock(inst303_out), .aclr(inst304_out), .q(inst349_q));
  and inst311 (inst311_out, Set[0], offset7, write_tag_clk);
  and inst310 (inst310_out, Set[1], offset7, write_tag_clk);
  and inst309 (inst309_out, Set[2], offset7, write_tag_clk);
  and inst308 (inst308_out, set3, offset7, write_tag_clk);
  and inst307 (inst307_out, set4, offset7, write_tag_clk);
  and inst306 (inst306_out, set5, offset7, write_tag_clk);
  and inst305 (inst305_out, set6, offset7, write_tag_clk);
  and inst304 (inst304_out, set7, offset7, write_tag_clk);
  lpm_bustri0 inst262 (.enabledt(read_clk), .data(inst67_tridata), .tridata(data));
  lpm_bustri2 inst312 (.enabledt(Set[0]), .data(inst295_q), .tridata(line_changed));
  lpm_bustri2 inst318 (.enabledt(Set[1]), .data(inst343_q), .tridata(line_changed));
  lpm_bustri2 inst319 (.enabledt(Set[2]), .data(inst344_q), .tridata(line_changed));
  lpm_bustri2 inst320 (.enabledt(set3), .data(inst345_q), .tridata(line_changed));
  lpm_bustri2 inst321 (.enabledt(set4), .data(inst346_q), .tridata(line_changed));
  lpm_bustri2 inst330 (.enabledt(set5), .data(inst347_q), .tridata(line_changed));
  lpm_bustri2 inst341 (.enabledt(set6), .data(inst348_q), .tridata(line_changed));
  lpm_bustri2 inst342 (.enabledt(set7), .data(inst349_q), .tridata(line_changed));
  and inst322 (inst322_out, Set[0], offset7, write_tag_clk);
  and inst323 (inst323_out, Set[1], offset7, write_tag_clk);
  and inst324 (inst324_out, Set[2], offset7, write_tag_clk);
  and inst325 (inst325_out, set3, offset7, write_tag_clk);
  and inst326 (inst326_out, set4, offset7, write_tag_clk);
  and inst327 (inst327_out, set5, offset7, write_tag_clk);
  and inst328 (inst328_out, set6, offset7, write_tag_clk);
  and inst329 (inst329_out, set7, offset7, write_tag_clk);
  lpm_dff2 inst333 (.data(vcc), .clock(inst322_out), .q(inst333_q));
  lpm_dff2 inst334 (.data(vcc), .clock(inst323_out), .q(inst334_q));
  lpm_dff2 inst335 (.data(vcc), .clock(inst324_out), .q(inst335_q));
  lpm_dff2 inst336 (.data(vcc), .clock(inst325_out), .q(inst336_q));
  lpm_dff2 inst337 (.data(vcc), .clock(inst326_out), .q(inst337_q));
  lpm_dff2 inst338 (.data(vcc), .clock(inst327_out), .q(inst338_q));
  lpm_dff2 inst339 (.data(vcc), .clock(inst328_out), .q(inst339_q));
  lpm_dff2 inst340 (.data(vcc), .clock(inst329_out), .q(inst340_q));
  lpm_bustri2 inst195 (.enabledt(Set[0]), .data(inst333_q), .tridata(line_not_empty));
  lpm_bustri2 inst196 (.enabledt(Set[1]), .data(inst334_q), .tridata(line_not_empty));
  lpm_bustri2 inst288 (.enabledt(Set[2]), .data(inst335_q), .tridata(line_not_empty));
  lpm_bustri2 inst313 (.enabledt(set3), .data(inst336_q), .tridata(line_not_empty));
  lpm_bustri2 inst314 (.enabledt(set4), .data(inst337_q), .tridata(line_not_empty));
  lpm_bustri2 inst315 (.enabledt(set5), .data(inst338_q), .tridata(line_not_empty));
  lpm_bustri2 inst316 (.enabledt(set6), .data(inst339_q), .tridata(line_not_empty));
  lpm_bustri2 inst317 (.enabledt(set7), .data(inst340_q), .tridata(line_not_empty));
endmodule
